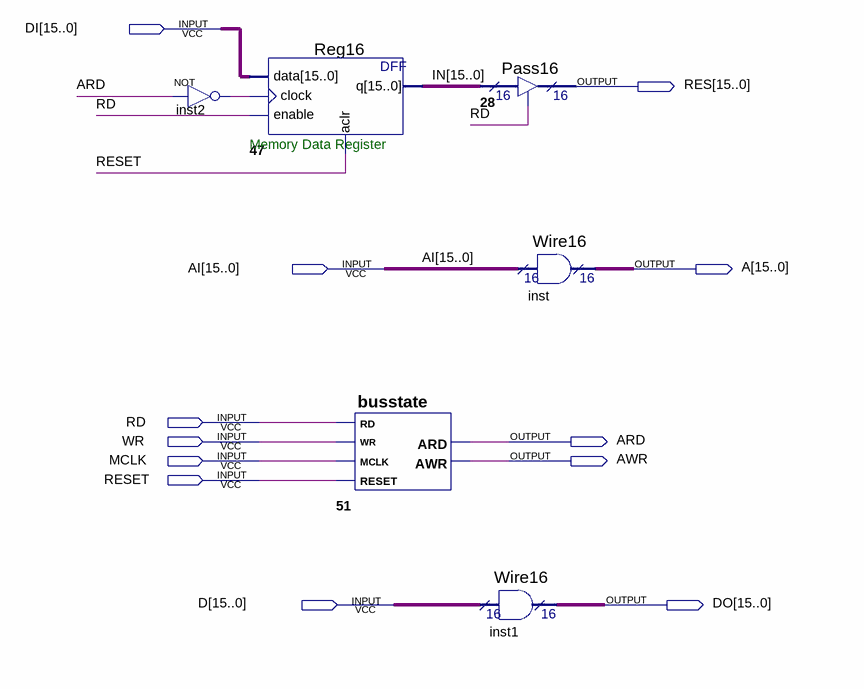
[diagram p0: schematic sheet]
// Quartus schematic busctrll.bdf as structural Verilog: 6 symbols, 12 pins
module busctrll (
  input  [15:0] DI,
  input  [15:0] AI,
  input  RD,
  input  WR,
  input  MCLK,
  input  RESET,
  input  [15:0] D,
  output [15:0] RES,
  output [15:0] A,
  output ARD,
  output AWR,
  output [15:0] DO
);

  wire inst2_out;
  wire [15:0] IN;

  not inst2 (inst2_out, ARD);
  Reg16 u_47 (.data(DI), .clock(inst2_out), .enable(RD), .aclr(RESET), .q(IN));
  busstate u_51 (.RD(RD), .WR(WR), .MCLK(MCLK), .RESET(RESET), .ARD(ARD), .AWR(AWR));
  Pass16 u_28 (.enabledt(RD), .data(IN), .tridata(RES));
  Wire16 inst1 (.data0x(D), .result(DO));
  Wire16 inst (.data0x(AI), .result(A));

  // Notes on the sheet:
  //   Memory Data Register
endmodule
